# Altium project temp-press.PrjPcb
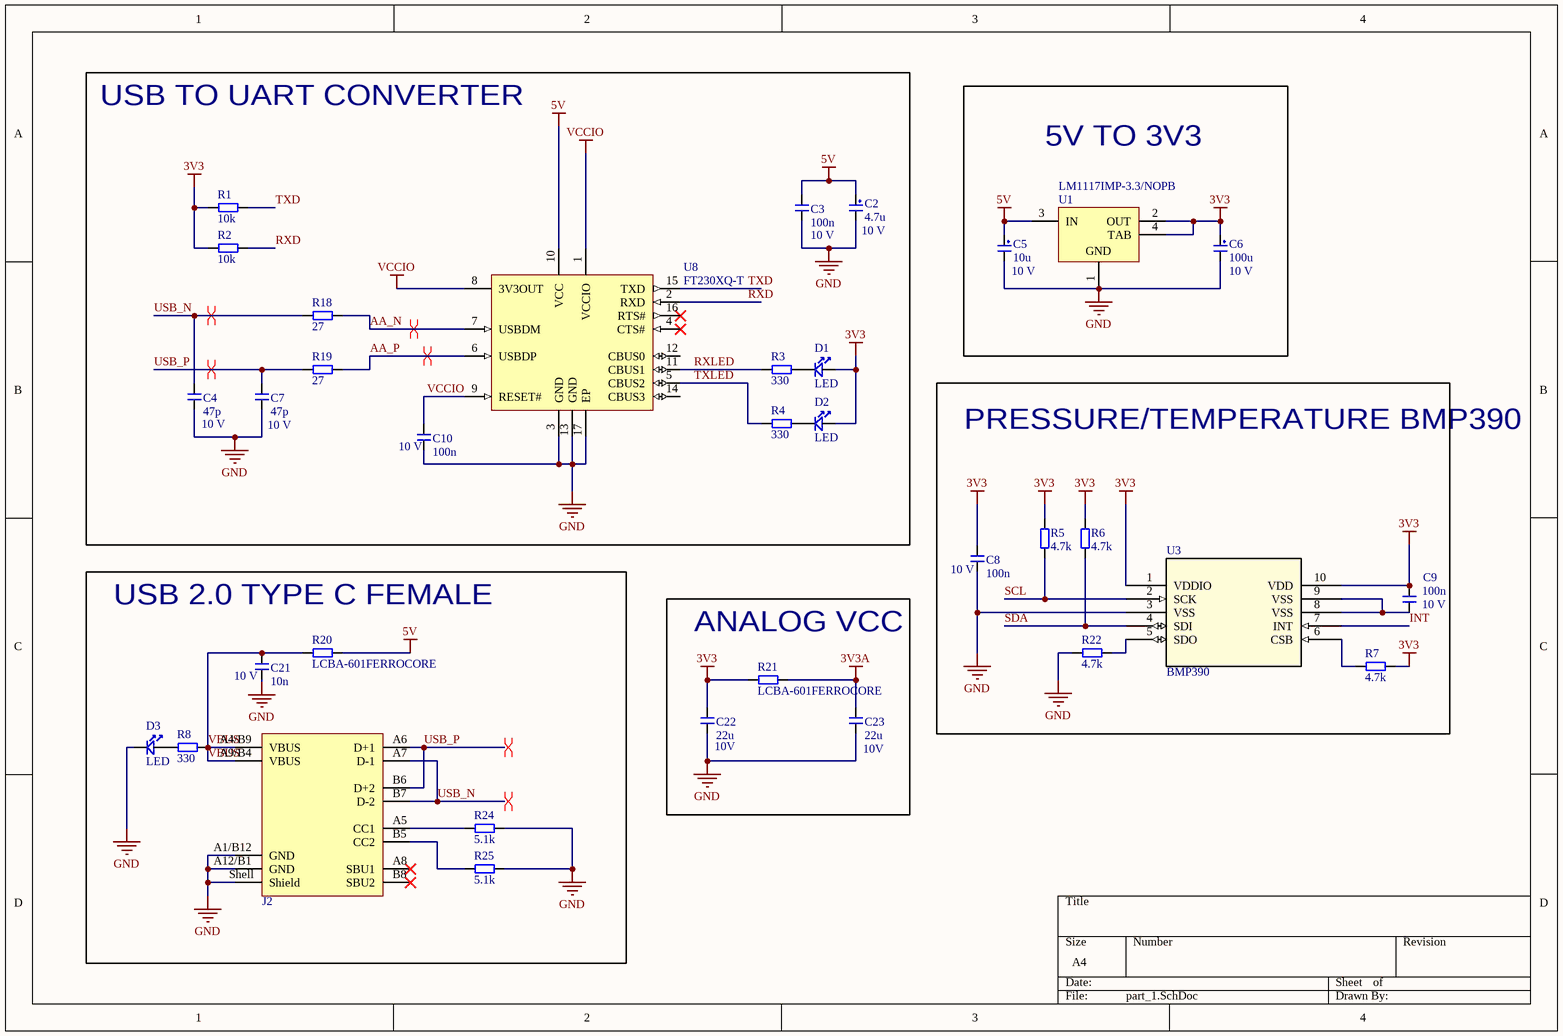
[diagram p0: part_1.SchDoc]
2 sheets, 66 parts. Net scope: global (net labels, ports and power ports of the same name join across sheets).
Board file: K.Ambrozinski_PCB1.PcbDoc
Sheets:
  part_1.SchDoc
  part_2.SchDoc

## Sheet part_1.SchDoc
size A4; SheetNumber: 1; SheetTotal: 2; V: 10 V

### Parts
C2  4.7u  VOLTAGE: 10 V  [TANT_A]
C3  100n  V: 10 V  [0603]
C4  47p  VOLTAGE: 10 V  [0603]
C5  10u  VOLTAGE: 10 V  [TANT_A]
C6  100u  VOLTAGE: 10 V  [TANT_A]
C7  47p  VOLTAGE: 10 V  [0603]
C8  100n  V: 10 V  [0603]
C9  100n  V: 10 V  [0603]
C10  100n  V: 10 V  [0603]
C21  10n  VOLTAGE: 10 V  [0603]
C22  22u  V: 10V  [0603]
C23  22u  V: 10V  [0603]
D1  LED  [Dioda_0805]
D2  LED  [Dioda_0805]
D3  LED  [Dioda_0805]
J2  629722000214  [629722000214]  (value not drawn)
R1  10k  [0603]
R2  10k  [0603]
R3  330  [0603]
R4  330  [0603]
R5  4.7k  [0603]
R6  4.7k  [0603]
R7  4.7k  [0603]
R8  330  [0603]
R18  27  [0603]
R19  27  [0603]
R20  LCBA-601FERROCORE  [0402]
R21  LCBA-601FERROCORE  [0402]
R22  4.7k  [0603]
R24  5.1k  [0402]
R25  5.1k  [0402]
U1  LM1117IMP-3.3/NOPB  [DCY0004A_N]
U3  BMP390  [10LGA_2X2X0p75_BOS]
U8  FT230XQ-T  [QFN-16_N]

### Blocks framed on the sheet
USB TO UART CONVERTER: C2-C4 C7 C10 D1 D2 R1-R4 R18 R19 U8
5V TO 3V3: C5 C6 U1
PRESSURE/TEMPERATURE BMP390: C8 C9 R5-R7 R22 U3
USB 2.0 TYPE C FEMALE: C21 D3 J2 R8 R20 R24 R25
ANALOG VCC: C22 C23 R21

### Nets
3V3: C6.1 C8.2 C9.2 C22.2 D1.2 D2.2 R1.2 R2.2 R5.2 R6.2 R7.2 R21.1 U1.2(OUT) U1.4(TAB) U3.1(VDDIO) U3.10(VDD)
3V3A: C23.2 R21.2
5V: C2.1 C3.2 C5.1 R20.2 U1.3(IN) U8.10(VCC)
GND: C2.2 C3.1 C4.1 C5.2 C6.2 C7.1 C8.1 C10.1 C21.1 C22.1 C23.1 D3.1 J2.A1/B12(GND) J2.A12/B1(GND) J2.Shell(Shield) R22.1 R24.2 R25.2 U1.1(GND) U3.3(VSS) U8.3(GND) U8.13(GND) U8.17(EP)
VCCIO: C10.2 U8.1(VCCIO) U8.8(3V3OUT) U8.9(RESET#)
AA_N: R18.1 U8.7(USBDM)
AA_P: R19.1 U8.6(USBDP)
INT: U3.7(INT)
RXD: R2.1 U8.2(RXD)
RXLED: R3.1 U8.11(CBUS1)
SCL: R5.1 U3.2(SCK)
SDA: R6.1 U3.4(SDI)
TXD: R1.1 U8.15(TXD)
TXLED: R4.1 U8.5(CBUS2)
USB_N: C4.2 J2.A7(D-1) J2.B7(D-2) R18.2
USB_P: C7.2 J2.A6(D+1) J2.B6(D+2) R19.2
VBUS: C21.2 J2.A4/B9(VBUS) J2.A9/B4(VBUS) R8.1 R20.1
NetC9_1: C9.1 U3.8(VSS) U3.9(VSS)
NetD1_1: D1.1 R3.2
NetD2_1: D2.1 R4.2
NetD3_2: D3.2 R8.2
NetJ2_A5: J2.A5(CC1) R24.1
NetJ2_B5: J2.B5(CC2) R25.1
NetR7_1: R7.1 U3.6(CSB)
NetR22_2: R22.2 U3.5(SDO)

Not connected (* = marked no-connect by the designer): J2 A8(SBU1)* B8(SBU2)*; U8 4(CTS#)* 12(CBUS0) 14(CBUS3) 16(RTS#)*

### Layout directives
differential pair; differential pair class 90ohm: USB_N, USB_P
differential pair: AA_N, AA_P

### Library data of the parts
C2 C5 C6 = CapP: kondensator tantalowy
C3 C4 C7-C10 C22 C23 = CapN: kondensator ceramiczny
  C3 C8-C10: VOLTAGE: 10 V
  C4 C7: V: 10 V
C21 = CapN: kondensator ceramiczny; Parameter 1: 10V
D1-D3 = Dioda_LED: Dioda LED SMD
J2 = 629722000214: WR-COM USB 2.0 Type C Receptacle Horizontal SMT; Manufacturer: Wurth Elektronik; Match Code: WR-USB; Interface Type: Type C; Number of Ports: 1; Rated Current: 5A; Working Voltage: 20V (DC); Manufacturer Part Number: 629722000214; Category: Input/Output Connectors; ComponentLink1Description: Website Link; ComponentLink1URL: https://www.we-online.com/redexpert/article/629722000214?ad; ComponentLink2Description: Datasheet Link; ComponentLink2URL: https://www.we-online.com/redexpert/spec/629722000214?ad; Mount: Surface Mount; Operating Temperature Max: 85°C; Operating Temperature Min: -40°C; Packaging: Tape and Reel; Application: USB 2.0; Gender: Receptacle; Number of Pins: 16; Orientation: Horizontal
R1-R8 R18-R22 R24 R25 = Res: Rezystor SMD
U1 = CMP-0062-01631-4: 800mA Low-Dropout Linear Regulator, 4-pin SOT-223, Pb-Free; Manufacturer: Texas Instruments; PackageTopMarking: XYTT*N05B; PowerWise: N; High-Reliability: Y; CompType: LDO IC; Code_IPC: SOT223-4; PackageReference: DCY0004A; PinCount: 4; PackageDescription: Molded SOT-223, 6.50 x 3.56 x 1.6mm Body, 4 Lead, 2.3mm Pitch; PartNumber: LM1117IMP-3.3/NOPB; RoHS: Y; ComponentLink1Description: Datasheet URL; Code_JEDEC: TO-261-AA; ComponentLink1URL: http://www.ti.com/general/docs/lit/getliterature.tsp?genericPartNumber=LM1117-N&fileType=pdf
U3 = BMP390: No Description Available; Mfr_Name: Bosch Sensortec; RefDes: RefDes; Type: Type
U8 = FT230XQ-T: USB to Basic UART Interface Chip, UHCI/OHCI/EHCI Compatible, USB 2.0 Compatible, -40 to +85 degC, 16-Pin QFN, Pb-Free, Tray; Manufacturer: FTDI; DatasheetVersion: ver 1.2, Feb-2013; PackageVersion: Feb-13; PackageReference: QFN-16; PackageDescription: 16-Pin Quad Flat No-Lead, 4x4 mm Body, 0.65 mm Pitch; Code_JEDEC: MO-220WGGC; PartNumber: FT230XQ-T; ComponentLink1Description: Manufacturer URL; ComponentLink1URL: http://www.ftdichip.com/; ComponentLink2Description: Datasheet; ComponentLink2URL: http://www.ftdichip.com/Support/Documents/DataSheets/ICs/DS_FT230X.pdf; ComponentLink3Description: FT230X Product Page; ComponentLink3URL: www.ftdichip.com/Products/ICs/FT230X.html

## Sheet part_2.SchDoc
size A4; SheetNumber: 2; SheetTotal: 2
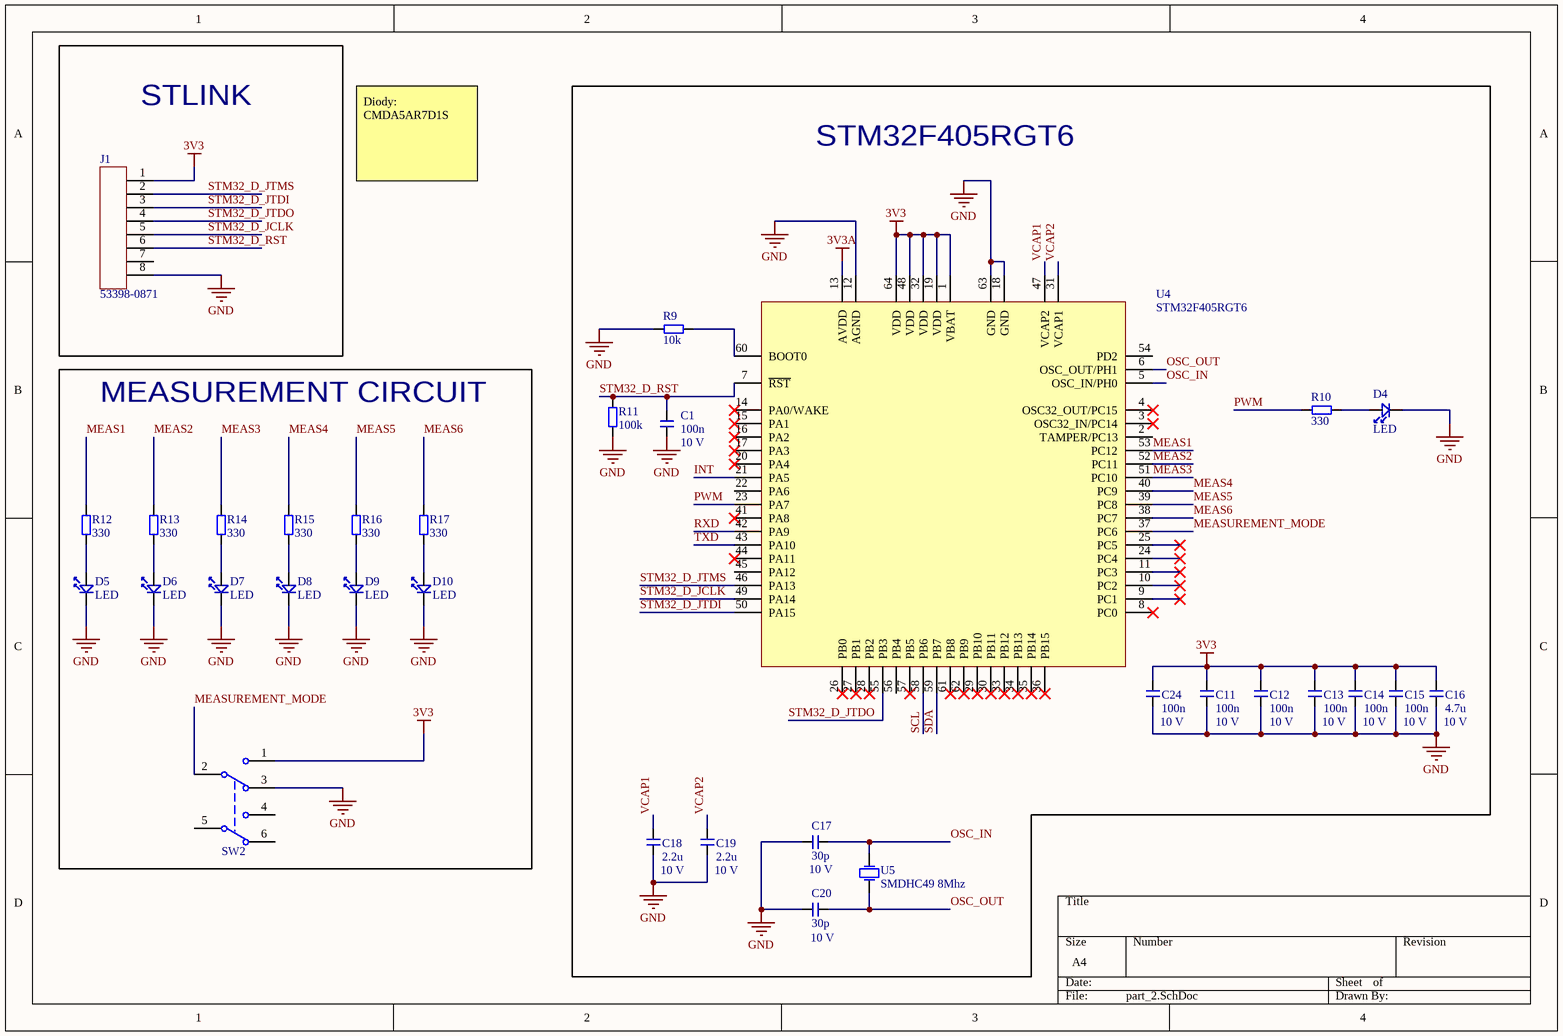
[diagram p1: part_2.SchDoc]

### Parts
C1  100n  V: 10 V  [0603]
C11  100n  V: 10 V  [0603]
C12  100n  V: 10 V  [0603]
C13  100n  V: 10 V  [0603]
C14  100n  V: 10 V  [0603]
C15  100n  V: 10 V  [0603]
C16  4.7u  V: 10 V  [0603]
C17  30p  V: 10 V  [0603]
C18  2.2u  V: 10 V  [0603]
C19  2.2u  V: 10 V  [0603]
C20  30p  V: 10 V  [0603]
C24  100n  V: 10 V  [0603]
D4  LED  [Dioda_0805]
D5  LED  [Dioda_0805]
D6  LED  [Dioda_0805]
D7  LED  [Dioda_0805]
D8  LED  [Dioda_0805]
D9  LED  [Dioda_0805]
D10  LED  [Dioda_0805]
J1  53398-0871  [53398-0871]
R9  10k  [0603]
R10  330  [0603]
R11  100k  [0603]
R12  330  [0603]
R13  330  [0603]
R14  330  [0603]
R15  330  [0603]
R16  330  [0603]
R17  330  [0603]
SW2  452403012014  [452403012014]  (value not drawn)
U4  STM32F405RGT6  [LQFP 64 0.5]
U5  SMDHC49 8Mhz  [SMDHC_49]

### Blocks framed on the sheet
STLINK: J1
STM32F405RGT6: C1 C11-C20 C24 D4 R9-R11 U4 U5
MEASUREMENT CIRCUIT: D5-D10 R12-R17 SW2

### Nets
3V3: C11.2 C12.2 C13.2 C14.2 C15.2 C16.2 C24.2 J1.1 SW2.1 U4.1(VBAT) U4.19(VDD) U4.32(VDD) U4.48(VDD) U4.64(VDD)
3V3A: U4.13(AVDD)
GND: C1.1 C11.1 C12.1 C13.1 C14.1 C15.1 C16.1 C17.2 C18.1 C19.1 C20.2 C24.1 D4.1 D5.1 D6.1 D7.1 D8.1 D9.1 D10.1 J1.8 R9.1 R11.1 SW2.3 U4.12(AGND) U4.18(GND) U4.63(GND)
INT: U4.21(PA5)
MEAS1: R12.2 U4.53(PC12)
MEAS2: R13.2 U4.52(PC11)
MEAS3: R14.2 U4.51(PC10)
MEAS4: R15.2 U4.40(PC9)
MEAS5: R16.2 U4.39(PC8)
MEAS6: R17.2 U4.38(PC7)
MEASUREMENT_MODE: SW2.2(COM) U4.37(PC6)
OSC_IN: C17.1 U4.5(OSC_IN/PH0) U5.2(OSC2)
OSC_OUT: C20.1 U4.6(OSC_OUT/PH1) U5.1(OSC1)
PWM: R10.1 U4.23(PA7)
RXD: U4.42(PA9)
SCL: U4.58(PB6)
SDA: U4.59(PB7)
STM32_D_JCLK: J1.5 U4.49(PA14)
STM32_D_JTDI: J1.3 U4.50(PA15)
STM32_D_JTDO: J1.4 U4.55(PB3)
STM32_D_JTMS: J1.2 U4.46(PA13)
STM32_D_RST: C1.2 J1.6 R11.2 U4.7(~{RST})
TXD: U4.43(PA10)
VCAP1: C18.2 U4.47(VCAP2)
VCAP2: C19.2 U4.31(VCAP1)
NetD4_2: D4.2 R10.2
NetD5_2: D5.2 R12.1
NetD6_2: D6.2 R13.1
NetD7_2: D7.2 R14.1
NetD8_2: D8.2 R15.1
NetD9_2: D9.2 R16.1
NetD10_2: D10.2 R17.1
NetR9_2: R9.2 U4.60(BOOT0)

Not connected (* = marked no-connect by the designer): J1 7; SW2 4 5(COM) 6; U4 2(TAMPER/PC13) 3(OSC32_IN/PC14)* 4(OSC32_OUT/PC15)* 8(PC0)* 9(PC1)* 10(PC2)* 11(PC3)* 14(PA0/WAKE)* 15(PA1)* 16(PA2)* 17(PA3)* 20(PA4)* 22(PA6) 24(PC4)* 25(PC5)* 26(PB0)* 27(PB1)* 28(PB2)* 29(PB10)* 30(PB11)* 33(PB12)* 34(PB13)* 35(PB14)* 36(PB15)* 41(PA8)* 44(PA11)* 45(PA12) 54(PD2) 56(PB4) 57(PB5)* 61(PB8)* 62(PB9)*

### Notes on the sheet
- Diody: CMDA5AR7D1S

### Library data of the parts
C1 C11-C20 C24 = CapN: kondensator ceramiczny
D4-D10 = Dioda_LED: Dioda LED SMD
J1 = CON8: Molex PicoBlade 8pin; Producent: Molex
R9-R17 = Res: Rezystor SMD
SW2 = 452403012014: WS-SLSV SMT Mini Slide Switch, Same Side Connection, DPDT, 6VDC, 300mA, 350g; Manufacturer: Wurth Elektronik; ComponentLink1Description: Website Link; ComponentLink1URL: https://www.we-online.com/redexpert/article/452403012014?ad; ComponentLink2Description: Datasheet Link; ComponentLink2URL: https://www.we-online.com/redexpert/spec/452403012014?ad; Manufacturer Part Number: 452403012014; Category: Slide Switches; Match Code: WS-SLSV; Mount: Surface Mount; Operating Temperature Max: 85°C; Operating Temperature Min: -40°C; Packaging: Tape and Reel; Length: 7.7mm; Width: 5.5mm; Height: 3.3mm; Circuit: DPDT; Contact Material: Copper Alloy; Contact Plating: Silver; Operation Force: 350g; Rated Current: 300mA; Rated Voltage: 6VDC; Terminal Material: Copper Alloy; Terminal Plating: Silver
U4 = STM32F415RGT6: STM32F415, 64 leads, LQFP
U5 = kwarc: rezonator kwarcowy

## Nets that join several sheets
3V3: part_1 (16 pins), part_2 (14 pins)
3V3A: part_1 (C23.2 R21.2), part_2 (U4.13)
GND: part_1 (23 pins), part_2 (26 pins)
INT: part_1 (U3.7), part_2 (U4.21)
RXD: part_1 (R2.1 U8.2), part_2 (U4.42)
SCL: part_1 (R5.1 U3.2), part_2 (U4.58)
SDA: part_1 (R6.1 U3.4), part_2 (U4.59)
TXD: part_1 (R1.1 U8.15), part_2 (U4.43)